# Altium schematic sheet MainBoard_Top.SchDoc
size A
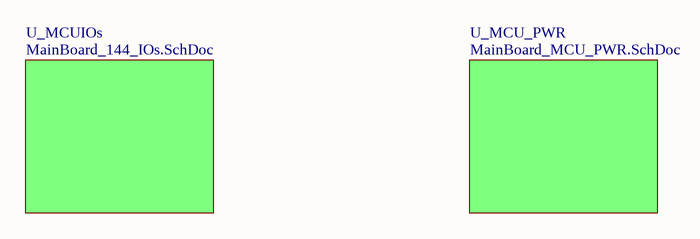
[diagram p0: MainBoard_Top.SchDoc]

## Sub-sheets
U_MCU_PWR = MainBoard_MCU_PWR.SchDoc: no entries
U_MCUIOs = MainBoard_144_IOs.SchDoc: no entries